# Altium schematic sheet Flomio BLE-NFC - LED Array.SchDoc: Flomio BLE-NFC::LED Array
size Tabloid; Author: Alex J. Tucker; CompanyName: Anidea Engineering, Inc.; DrawnBy: Alex J. Tucker; Engineer: Alex J. Tucker; Organization: Anidea Engineering, Inc.; Address1: 8020 Belvedere Rd.; Address2: Ste #1; Address3: West Palm Beach, FL; Address4: 33411    USA; DocumentNumber: 4; Revision: 3; SheetNumber: 4; SheetTotal: 5
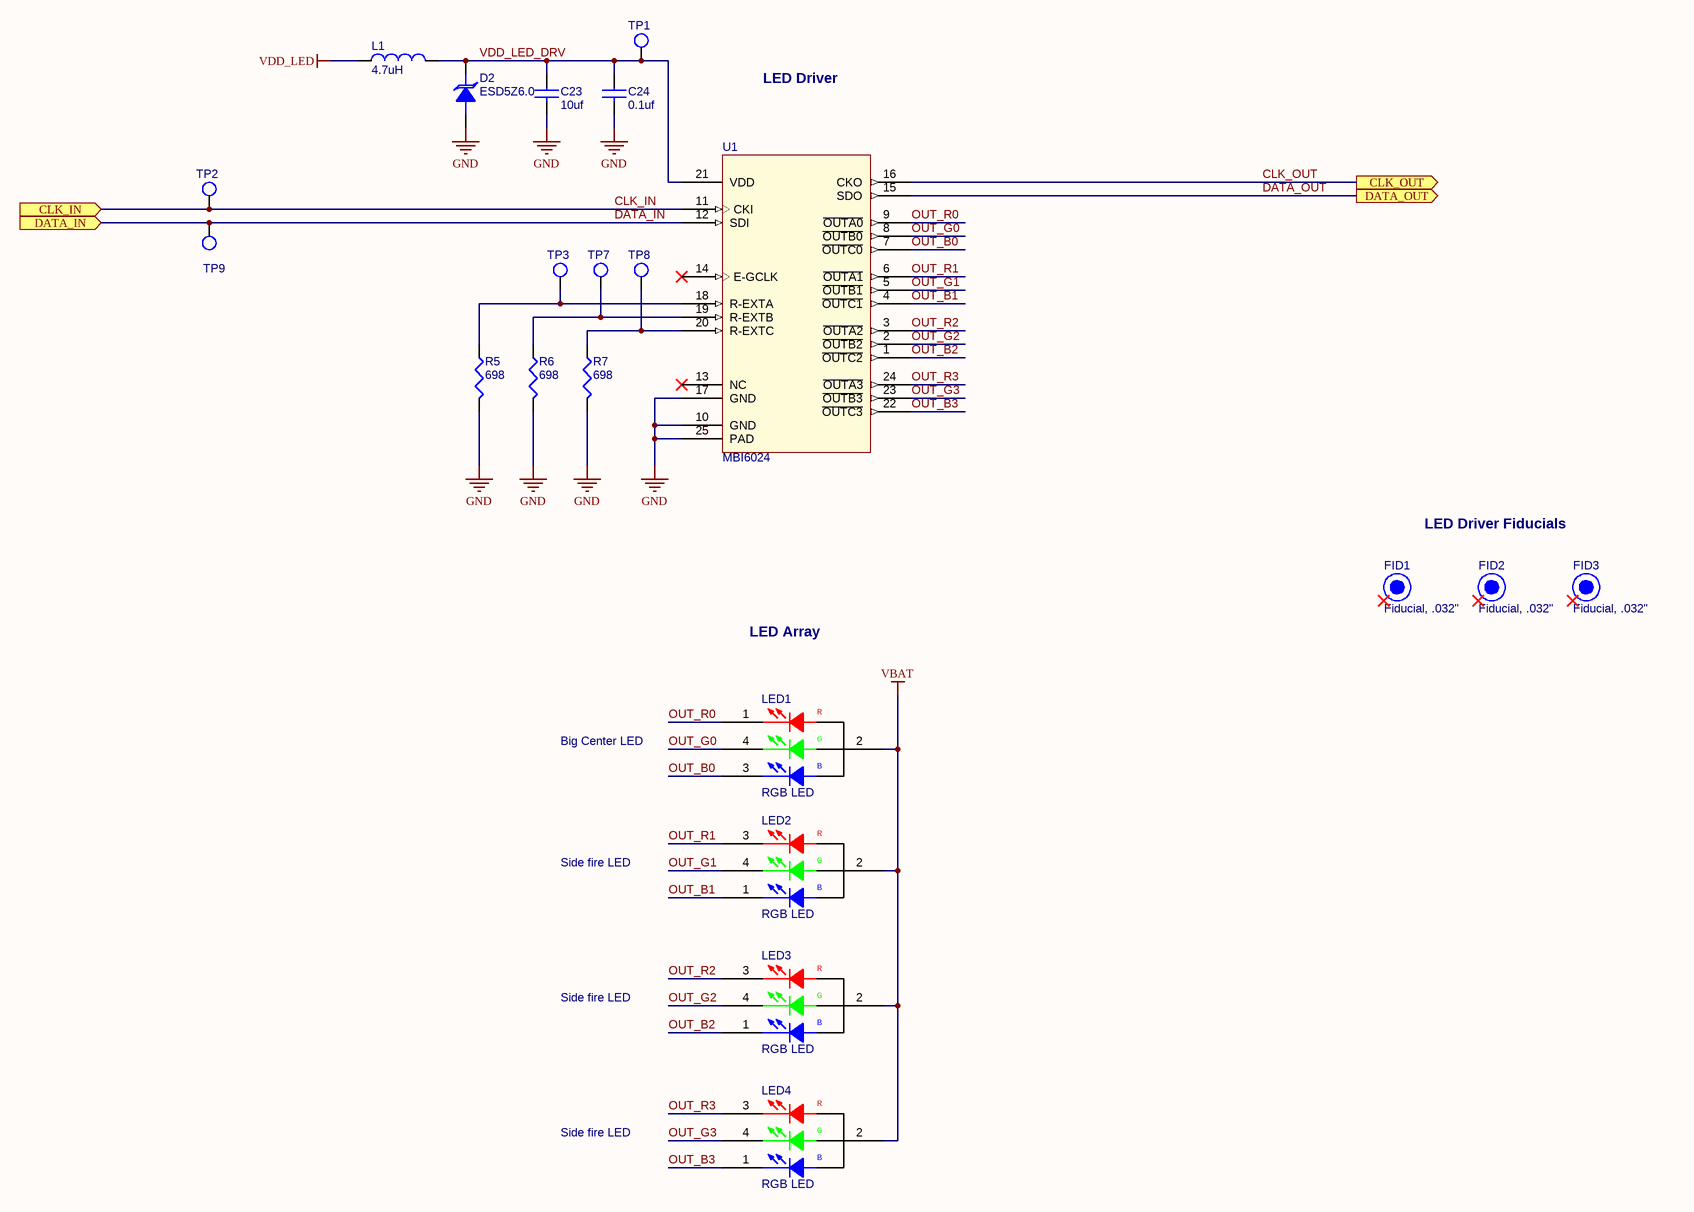
[diagram p0: Flomio BLE-NFC - LED Array.SchDoc]

## Parts
C23  10uf  [SM/C_0603]
C24  0.1uf  [SM/C_0402]
D2  ESD5Z6.0  [SOD-523]
FID1  Fiducial, .032"  [FID32]  (no BOM)
FID2  Fiducial, .032"  [FID32]  (no BOM)
FID3  Fiducial, .032"  [FID32]  (no BOM)
L1  4.7uH  [SM/I_0805]
LED1  RGB LED  [LED/PLCC4;LED/PLCC4/NOSLK]
LED2  RGB LED  [LED/AVAGO/HSMF-C115]
LED3  RGB LED  [LED/AVAGO/HSMF-C115]
LED4  RGB LED  [LED/AVAGO/HSMF-C115]
R5  698  [SM/R_0402]
R6  698  [SM/R_0402]
R7  698  [SM/R_0402]
TP1  TP  [VIA18]  (value not drawn)  (no BOM)
TP2  TP  [VIA18]  (value not drawn)  (no BOM)
TP3  TP  [VIA18]  (value not drawn)  (no BOM)
TP7  TP  [VIA18]  (value not drawn)  (no BOM)
TP8  TP  [VIA18]  (value not drawn)  (no BOM)
TP9  TP  [VIA18]  (value not drawn)  (no BOM)
U1  MBI6024  [QFN50P400X400X80-24N]

## Ports
CLK_IN (in), CLK_OUT (out), DATA_IN (in), DATA_OUT (out)

## Nets
GND: C23.2 C24.2 D2.1(ANODE) R5.2 R6.2 R7.2 U1.10(GND) U1.17(GND) U1.25(PAD)
VBAT: LED1.2(ANODDE) LED2.2(ANODDE) LED3.2(ANODDE) LED4.2(ANODDE)
VDD_LED: L1.1
CLK_IN: TP2.1(TP) U1.11(CKI) ; port CLK_IN
CLK_OUT: U1.16(CKO) ; port CLK_OUT
DATA_IN: TP9.1(TP) U1.12(SDI) ; port DATA_IN
DATA_OUT: U1.15(SDO) ; port DATA_OUT
OUT_B0: LED1.3(BLUEK) U1.7(~{OUTC0})
OUT_B1: LED2.1(BLUEK) U1.4(~{OUTC1})
OUT_B2: LED3.1(BLUEK) U1.1(~{OUTC2})
OUT_B3: LED4.1(BLUEK) U1.22(~{OUTC3})
OUT_G0: LED1.4(GREENK) U1.8(~{OUTB0})
OUT_G1: LED2.4(GREENK) U1.5(~{OUTB1})
OUT_G2: LED3.4(GREENK) U1.2(~{OUTB2})
OUT_G3: LED4.4(GREENK) U1.23(~{OUTB3})
OUT_R0: LED1.1(REDK) U1.9(~{OUTA0})
OUT_R1: LED2.3(REDK) U1.6(~{OUTA1})
OUT_R2: LED3.3(REDK) U1.3(~{OUTA2})
OUT_R3: LED4.3(REDK) U1.24(~{OUTA3})
VDD_LED_DRV: C23.1 C24.1 D2.2(CATHODE) L1.2 TP1.1(TP) U1.21(VDD)
NetR5_1: R5.1 TP3.1(TP) U1.18(R-EXTA)
NetR6_1: R6.1 TP7.1(TP) U1.19(R-EXTB)
NetR7_1: R7.1 TP8.1(TP) U1.20(R-EXTC)

Not connected (* = marked no-connect by the designer): FID1 1*; FID2 1*; FID3 1*; U1 13(NC)* 14(E-GCLK)*

## Notes on the sheet
- LED Driver
- LED Driver Fiducials
- LED Array
- Big Center LED
- Side fire LED
- Confidential Document
  Unauthorized Use or Release
  Prohibited
- Checked By:
- Designed By:
- Title
- Size:
- Date:
- Tabloid
- Number:
- Time:
- Revision:
- Sheet
- of
- Approved By:
- File:
- (in symbol CLVBA-FKA) R; G; B
- (in symbol HSMF-C115) R; G; B

## Library data of the parts
C23 = GRM188R60J106ME47: Cap, 0603, 10uf, 6.3V, 20%,; Mfg Part Number: GRM188R60J106ME47D; Mfg: Murata; Part Number: GRM188R60J106ME47; Tolerance: 20%; Voltage: 6.3V; ComponentLink1Description: Local; ComponentLink1URL: \\brak\public\pdf\Murata Cap PN.pdf; ComponentLink2Description: Web; Supplier Part Number 1: 490-3896-1-ND; Supplier 1: Digi-Key; RoHS: True
C24 = GRM155R71C104KA88: Cap, 0402, 0.1uf, 16V, 10%; Mfg Part Number: GRM155R71C104KA88D; Mfg: Murata; Part Number: GRM155R71C104KA88; Tolerance: 10%; Voltage: 16V; ComponentLink1Description: Local; ComponentLink1URL: \\brak\public\pdf\Murata Cap PN.pdf; ComponentLink2Description: Web; Supplier Part Number 1: 490-3261-1-ND; Supplier 1: Digi-Key; RoHS: True
D2 = ESD5Z6.0T1G: TVS, ESD, 6.0V, 30KV Pk, Unidirectional, SMT; Mfg: Onsemi; Rating: 240W; Part Number: ESD5Z6.0T1G; Voltage: 6.0V; Mfg Part Number: ESD5Z6.0T1G; ComponentLink1Description: Local; ComponentLink1URL: \\newbrak\public\pdf\Onsemi ESD5Z TVS-ESD.pdf; ComponentLink2Description: Web; Supplier Part Number 1: ESD5Z6.0T1GOSTR-ND; Supplier 1: Digi-Key; RoHS: True
FID1-FID3 = FID32: Fiducual, .032" Pad; Obsolete: False; Part Number: FID32; ComponentLink1Description: Local; ComponentLink1URL: \\brak\public\pdf\; ComponentLink2Description: Web; RoHS: False; Part Type: Misc\Fiducual
L1 = LQG21C4R7N00T1: Inductor, 4.7uH, 0805; Mfg: Murata; Rating: 30mA; Part Number: LQG21C4R7N00T1; Mfg Part Number: LQG21C4R7N00T1; ComponentLink1Description: Local; ComponentLink1URL: \\brak\public\pdf\\Murata SMT Inductors Chip Coils.pdf; ComponentLink2Description: Web; RoHS: True; ComponentLink2URL: http://search.murata.co.jp/Ceramy/image/img/PDF/ENG/L0075S0097LQM21D.pdf; Supplier Part Number 1: 490-1120-1-ND; Supplier 1: Digi-Key
LED1 = CLVBA-FKA: Diode, Led, RGB, PLCC4; Mfg Part Number: CLVBA-FKA-CAEDH8BBB7a36; Mfg: Cree; Part Number: CLVBA-FKA; ComponentLink1Description: Local; ComponentLink1URL: \\newbrak\public\pdf\Cree CLVBA-FKA RGB Led.pdf; ComponentLink2Description: Web; ComponentLink2URL: http://www.cree.com/products/pdf/ledlamps/CLVBA-FKA.pdf; Supplier Part Number 1: CLVBA-FKA-CAEDH8BBB7A363TR-ND; Supplier 1: Digi-key; RoHS: True
LED2-LED4 = HSMF-C115: Diode, Led, RGB, Side looking; Mfg: Avago; Part Number: HSMF-C115; Mfg Part Number: HSMF-C115; ComponentLink1Description: Local; ComponentLink1URL: \\brak\public\pdf\Avago AV02-0611EN LED.pdf; ComponentLink2Description: Web; ComponentLink2URL: http://www.avagotech.com/docs/AV02-0611EN; Supplier Part Number 1: HSMF-C115-ND; Supplier 1: Digi-key; RoHS: True
R5-R7 = CRCW0402698RFK: Resistor, 0402, 698 Ohm 1%; Mfg Part Number: CRCW0402698RFKED; Rating: 1/10W; Mfg: Vishay; Part Number: CRCW0402698RFK; Tolerance: 1%; ComponentLink1Description: Local; ComponentLink1URL: \\brak\public\pdf\Vishay CRCW Resistors.pdf; ComponentLink2Description: Web; Supplier Part Number 1: 541-698LCT-ND; Supplier 1: Digi-Key; RoHS: True
TP1-TP3 TP7-TP9 = TP18: Testpoint, 18mil Hole, No part, just via; Part Number: TP18; ComponentLink1Description: Local; ComponentLink2Description: Web; RoHS: False
U1 = MBI6024GFN: IC, Driver, 3x4 Led Driver, QFN24; Voltage: 5V; Mfg: Macroblock; Part Number: MBI6024GFN; Mfg Part Number: MBI6024GFN; ComponentLink1Description: Local; ComponentLink1URL: \\newbrak\public\pdf\Macroblock MBI6024 Preliminary Datasheet V2.00-EN.pdf; ComponentLink2Description: Web; ComponentLink2URL: http://www.mblock.com.tw/downfile.php?Code=ad13a2a07ca4b7642959dc0c4c740ab6; RoHS: True